# EAGLE schematic stepper_ctrl_v1 (EAGLE 6.5.0)
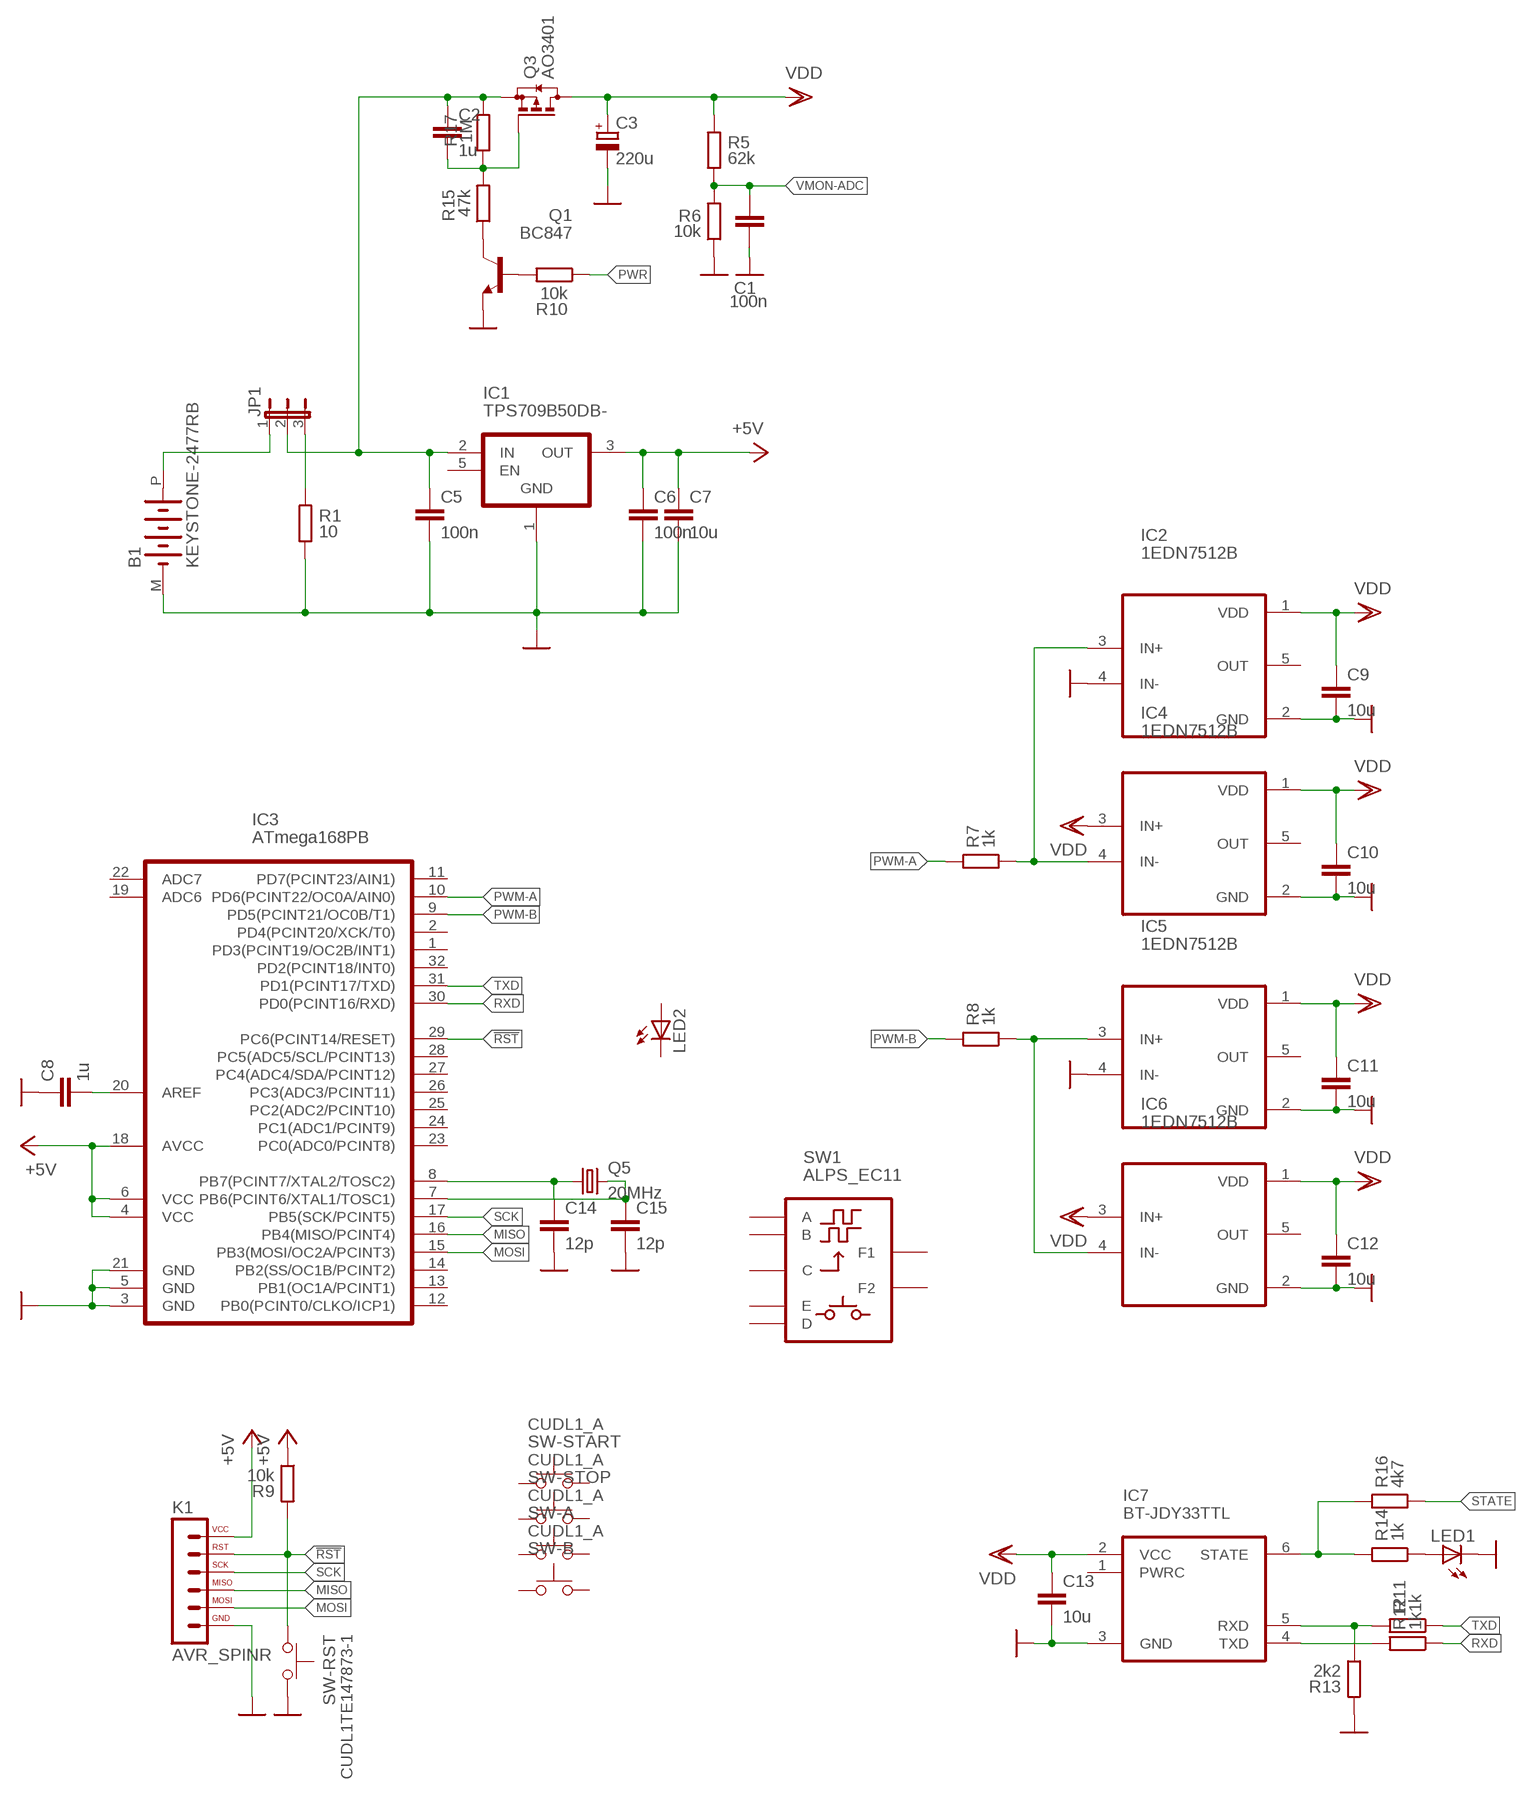
[diagram p0: schematic, sheet 1]

## Parts
B1  KEYSTONE-2477RB  [KEYSTONE-2477RB]
C1  100n  C-EUC0603K  [C0603K]
C2  1u  C-EUC0805K  [C0805K]
C3  220u  CPOL-EUE2.5-7  [E2,5-7]
C5  100n  C-EUC0805K  [C0805K]
C6  100n  C-EUC0805K  [C0805K]
C7  10u  C-EUC0805K  [C0805K]
C8  1u  C-EUC0805K  [C0805K]
C9  10u  C-EUC0805K  [C0805K]
C10  10u  C-EUC0805K  [C0805K]
C11  10u  C-EUC0805K  [C0805K]
C12  10u  C-EUC0805K  [C0805K]
C13  10u  C-EUC0805K  [C0805K]
C14  12p  C-EUC0603K  [C0603K]
C15  12p  C-EUC0603K  [C0603K]
IC1  TPS709B50DB-  [SOT23-5]
IC2  1EDN7512B  [SOT23-5]
IC3  ATmega168PB  ATMEGA88T  [TQFP32]
IC4  1EDN7512B  [SOT23-5]
IC5  1EDN7512B  [SOT23-5]
IC6  1EDN7512B  [SOT23-5]
IC7  BT-JDY33TTL  [BT-JFY33TTL]
JP1  JP2EB  [JP2YB]
K1  AVR_SPINR  [SIL6-NNRND]
LED1  LED3MM  [LED3MM]
LED2  LED3MM  [LED3MM]
Q1  BC847  BC847CLT1SMD  [SOT23]
Q3  AO3401  BSS84  [SOT23]
Q5  20MHz  CRYSTAL3225  [SMD32X25]
R1  10  R-EU_R0805  [R0805]
R5  62k  R-EU_R0603  [R0603]
R6  10k  R-EU_R0603  [R0603]
R7  1k  R-EU_R0603  [R0603]
R8  1k  R-EU_R0603  [R0603]
R9  10k  R-EU_R0603  [R0603]
R10  10k  R-EU_R0603  [R0603]
R11  1k  R-EU_R0603  [R0603]
R12  1k  R-EU_R0603  [R0603]
R13  2k2  R-EU_R0603  [R0603]
R14  1k  R-EU_R0603  [R0603]
R15  47k  R-EU_R0603  [R0603]
R16  4k7  R-EU_R0603  [R0603]
R17  1M  R-EU_R0603  [R0603]
SW1  ALPS_EC11  [ALPS_EC11]
SW-A  CUDL1_A  [CUDL1]
SW-B  CUDL1_A  [CUDL1]
SW-RST  CUDL1TE147873-1  [TE-147873-1]
SW-START  CUDL1_A  [CUDL1]
SW-STOP  CUDL1_A  [CUDL1]

## Nets
!RST: IC3.29(PC6(PCINT14/RESET)) K1.5 R9.2 SW-RST.P$2
+5V: C6.1 C7.1 IC1.3(OUT) IC3.4(VCC) IC3.6(VCC) IC3.18(AVCC) K1.6 R9.1
GND [main_tri]: B1.M(-) C1.2 C3.- C5.2 C6.2 C7.2 C8.1 C9.2 C10.2 C11.2 C12.2 C13.2 C14.2 C15.2 IC1.1(GND) IC2.2(GND) IC2.4(IN-) IC3.3(GND) IC3.5(GND) IC3.21(GND) IC4.2(GND) IC5.2(GND) IC5.4(IN-) IC6.2(GND) IC7.3(GND) K1.1 LED1.K(C) Q1.2(E) R1.1 R6.1 R13.2 SW-RST.P$1
MISO: IC3.16(PB4(MISO/PCINT4)) K1.3
MOSI: IC3.15(PB3(MOSI/OC2A/PCINT3)) K1.2
N$1: IC2.3(IN+) IC4.4(IN-) R7.1
N$2: C8.2 IC3.20(AREF)
N$3 [main_tri]: C2.1 C5.1 IC1.2(IN) JP1.2 Q3.2(S) R17.1
N$4: B1.P(+) JP1.1
N$5: IC5.3(IN+) IC6.4(IN-) R8.1
N$6: JP1.3 R1.2
N$7: LED1.A R14.1
N$8: IC7.6(STATE) R14.2 R16.2
N$9: IC7.5(RXD) R11.2 R13.1
N$10: IC7.4(TXD) R12.2
N$11: C14.1 IC3.8(PB7(PCINT7/XTAL2/TOSC2)) Q5.1
N$12: C15.1 IC3.7(PB6(PCINT6/XTAL1/TOSC1)) Q5.3
N$13: Q1.1(B) R10.2
N$37: C2.2 Q3.1(G) R15.2 R17.2
N$47: Q1.3(C) R15.1
PWM-A: IC3.10(PD6(PCINT22/OC0A/AIN0)) R7.2
PWM-B: IC3.9(PD5(PCINT21/OC0B/T1)) R8.2
PWR: R10.1
RXD: IC3.30(PD0(PCINT16/RXD)) R12.1
SCK: IC3.17(PB5(SCK/PCINT5)) K1.4
STATE [main_tri]: R16.1
TXD: IC3.31(PD1(PCINT17/TXD)) R11.1
VDD: C3.+ C9.1 C10.1 C11.1 C12.1 C13.1 IC2.1(VDD) IC4.1(VDD) IC4.3(IN+) IC5.1(VDD) IC6.1(VDD) IC6.3(IN+) IC7.2(VCC) Q3.3(D) R5.2
VMON-ADC [main_tri]: C1.1 R5.1 R6.2
Unconnected: IC1.5(EN) IC2.5(OUT) IC3.1(PD3(PCINT19/OC2B/INT1)) IC3.2(PD4(PCINT20/XCK/T0)) IC3.11(PD7(PCINT23/AIN1)) IC3.12(PB0(PCINT0/CLKO/ICP1)) IC3.13(PB1(OC1A/PCINT1)) IC3.14(PB2(SS/OC1B/PCINT2)) IC3.19(ADC6) IC3.22(ADC7) IC3.23(PC0(ADC0/PCINT8)) IC3.24(PC1(ADC1/PCINT9)) IC3.25(PC2(ADC2/PCINT10)) IC3.26(PC3(ADC3/PCINT11)) IC3.27(PC4(ADC4/SDA/PCINT12)) IC3.28(PC5(ADC5/SCL/PCINT13)) IC3.32(PD2(PCINT18/INT0)) IC4.5(OUT) IC5.5(OUT) IC6.5(OUT) IC7.1(PWRC) LED2.A LED2.K(C) SW1.A SW1.B SW1.C SW1.D SW1.E SW1.F1 SW1.F2 SW-A.1 SW-A.2 SW-A.3 SW-A.4 SW-B.1 SW-B.2 SW-B.3 SW-B.4 SW-START.1 SW-START.2 SW-START.3 SW-START.4 SW-STOP.1 SW-STOP.2 SW-STOP.3 SW-STOP.4

## Library data of the parts
B1 = battery:KEYSTONE-2477RB: Keystone 2477RB 4xAA holder.
C1 C2 C5-C15 = rcl:C-EU: CAPACITOR, European symbol
C3 = rcl:CPOL-EU: POLARIZED CAPACITOR, European symbol
IC1 = ostatni:TPS709*: Texas, ultra low quiscent current LDO 2.7 - 30V input, ~1µA quiscent current. EN open or high to enable but EN voltage below 6.5V!. Maximum capacitance for stability is 47µF, minimum is 2.2µF. Careful to other pinout versions like 709Axx and 709Bxx!
IC2 IC4-IC6 = ostatni:1EDN7512B: FET driver 4/8A common output.
IC3 = ostatni:ATMEGA88T
IC7 = ostatni:BT-JDY33TTL: Bluetooth module JDY33TTL: https://www.laskakit.cz/bluetooth-modul-jdy-33-ttl
JP1 = jumper:JP2E: JUMPER
K1 = ostatni:AVR_SPI: SPI rozhranni pro muj kua programator AVR.
LED1 LED2 = led:LED: LED OSRAM: - CHIPLED LG R971, LG N971, LY N971, LG Q971, LY Q971, LO R971, LY R971 LH N974, LH R974 LS Q976, LO Q976, LY Q976 LO Q996 - Hyper CHIPLED LW Q18S LB Q993, LB Q99A, LB R99A - SideLED LS A670, LO A670, LY A670, LG A670, LP A670 LB A673, LV A673, LT A673, LW A673 LH A674 LY A675 LS A676, LA A676, LO A676, LY A676, LW A676 LS A679, LY A679, LG A679 - Hyper Micro SIDELED® LS Y876, LA Y876, LO Y876, LY Y876 LT Y87S - SmartLED LW L88C, LW L88S LB L89C, LB L89S, LG L890 LS L89K, LO L89K, LY L89K LS L896, LA L896, LO L896, LY L896 - TOPLED LS T670, LO T670, LY T670, LG T670, LP T670 LSG T670, LSP T670, LSY T670, LOP T670, LYG T670 LG T671, LOG T671, LSG T671 LB T673, LV T673, LT T673, LW T673 LH T674 LS T676, LA T676, LO T676, LY T676, LB T676, LH T676, LSB T676, LW T676 LB T67C, LV T67C, LT T67C, LS T67K, LO T67K, LY T67K, LW E67C LS E67B, LA E67B, LO E67B, LY E67B, LB E67C, LV E67C, LT E67C LW T67C LS T679, LY T679, LG T679 LS T770, LO T770, LY T770, LG T770, LP T770 LB T773, LV T773, LT T773, LW T773 LH T774 LS E675, LA E675, LY E675, LS T675 LS T776, LA T776, LO T776, LY T776, LB T776 LHGB T686 LT T68C, LB T68C - Hyper Mini TOPLED® LB M676 - Mini TOPLED Santana® LG M470 LS M47K, LO M47K, LY M47K Source: http://www.osram.convergy.de LUXEON: - LUMILED® LXK2-PW12-R00, LXK2-PW12-S00, LXK2-PW14-U00, LXK2-PW14-V00 LXK2-PM12-R00, LXK2-PM12-S00, LXK2-PM14-U00 LXK2-PE12-Q00, LXK2-PE12-R00, LXK2-PE12-S00, LXK2-PE14-T00, LXK2-PE14-U00 LXK2-PB12-K00, LXK2-PB12-L00, LXK2-PB12-M00, LXK2-PB14-N00, LXK2-PB14-P00, LXK2-PB14-Q00 LXK2-PR12-L00, LXK2-PR12-M00, LXK2-PR14-Q00, LXK2-PR14-R00 LXK2-PD12-Q00, LXK2-PD12-R00, LXK2-PD12-S00 LXK2-PH12-R00, LXK2-PH12-S00 LXK2-PL12-P00, LXK2-PL12-Q00, LXK2-PL12-R00 Source: www.luxeon.com KINGBRIGHT: KA-3528ASYC Source: www.kingbright.com
Q1 = transistor-npn:BC847*: NPN Transistor
Q3 = transistor-small-signal:BSS84: P-CHANNEL MOS FET
Q5 = crystal:CRYSTAL: CRYSTAL
R1 R5-R17 = rcl:R-EU_: RESISTOR, European symbol
SW1 = ostatni:ALPS_EC11: ALPS EC11 encoder with axial switch notes: C is common terminal for A,B pulse outputs F1, F2 are frame solder pads
SW-A SW-B SW-RST SW-START SW-STOP = butony:CUDL1

## Net classes
1 main_tri: clearance 0.305 mm
15 TC-PWR: clearance 0.254 mm